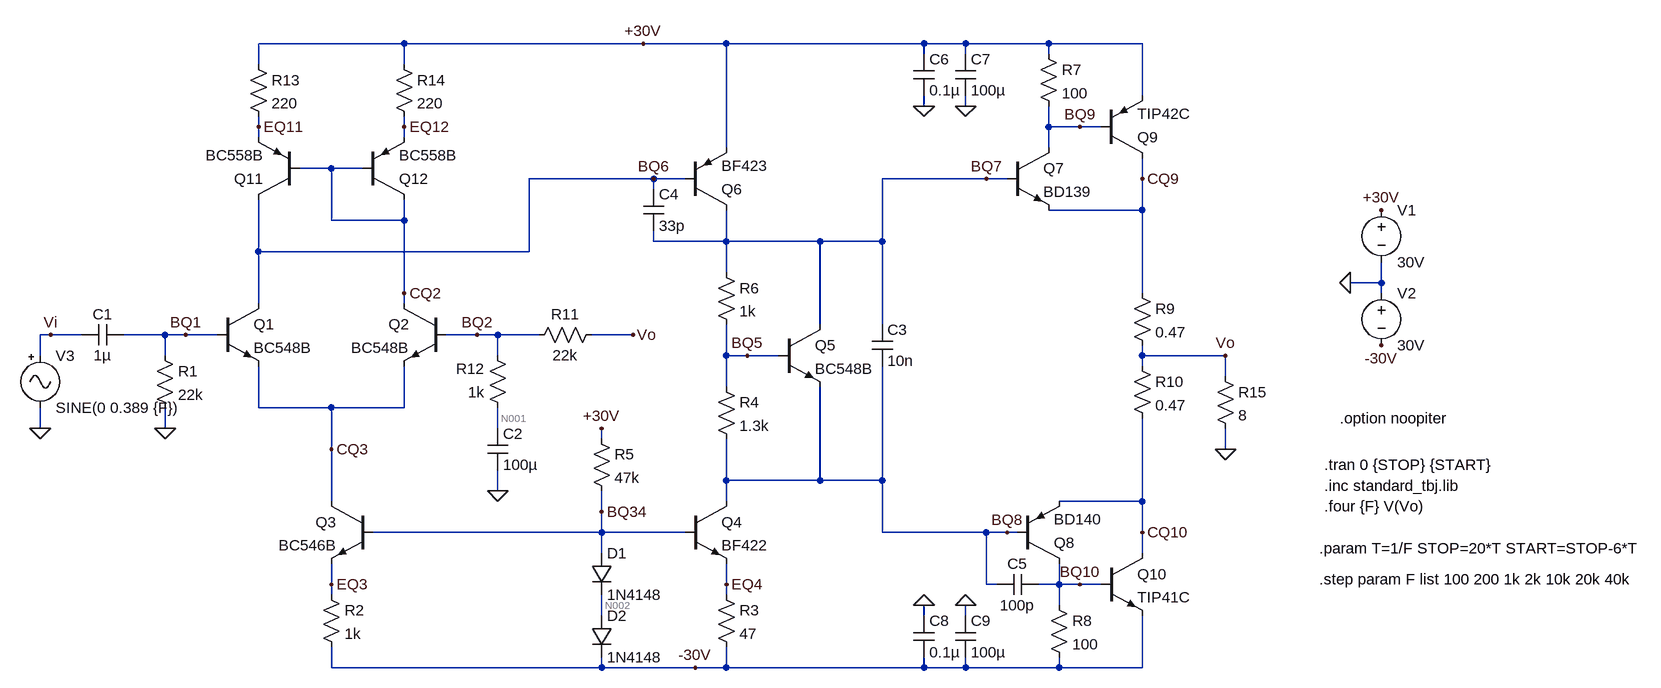
[diagram p0: schematic Clase_B_v3_THD.asc]
Clase_B_v3_THD.asc, the LTspice schematic file:
Version 4
SHEET 1 2480 1108
WIRE 96 -224 -128 -224
WIRE 464 -224 96 -224
WIRE 592 -224 464 -224
WIRE 896 -224 592 -224
WIRE 960 -224 896 -224
WIRE 1088 -224 960 -224
WIRE 1232 -224 1088 -224
WIRE 896 -208 896 -224
WIRE 960 -208 960 -224
WIRE 1088 -208 1088 -224
WIRE -128 -192 -128 -224
WIRE 96 -192 96 -224
WIRE 1232 -144 1232 -224
WIRE 896 -128 896 -144
WIRE 960 -128 960 -144
WIRE -128 -96 -128 -112
WIRE 96 -96 96 -112
WIRE 1088 -96 1088 -128
WIRE 1136 -96 1088 -96
WIRE 1168 -96 1136 -96
WIRE -128 -80 -128 -96
WIRE 96 -80 96 -96
WIRE 592 -64 592 -224
WIRE 1088 -64 1088 -96
WIRE -16 -32 -64 -32
WIRE 32 -32 -16 -32
WIRE 480 -16 288 -16
WIRE 528 -16 480 -16
WIRE 992 -16 832 -16
WIRE 1024 -16 992 -16
WIRE 1232 -16 1232 -48
WIRE 480 0 480 -16
WIRE 1232 32 1232 -16
WIRE 1232 32 1088 32
WIRE -16 48 -16 -32
WIRE 96 48 96 16
WIRE 96 48 -16 48
WIRE 480 80 480 64
WIRE 592 80 592 32
WIRE 592 80 480 80
WIRE 736 80 592 80
WIRE 832 80 832 -16
WIRE 832 80 736 80
WIRE -128 96 -128 16
WIRE 288 96 288 -16
WIRE 288 96 -128 96
WIRE 592 128 592 80
WIRE 1600 144 1600 112
WIRE 1600 144 1552 144
WIRE 96 160 96 48
WIRE 1232 160 1232 32
WIRE 1600 160 1600 144
WIRE -128 176 -128 96
WIRE 96 176 96 160
WIRE 736 208 736 80
WIRE 832 208 832 80
WIRE -448 224 -464 224
WIRE -400 224 -448 224
WIRE -272 224 -336 224
WIRE -240 224 -272 224
WIRE -192 224 -240 224
WIRE 208 224 160 224
WIRE 240 224 208 224
WIRE 304 224 240 224
WIRE 448 224 384 224
WIRE -464 256 -464 224
WIRE -272 256 -272 224
WIRE 240 256 240 224
WIRE 592 256 592 208
WIRE 624 256 592 256
WIRE 672 256 624 256
WIRE 1232 256 1232 240
WIRE 1360 256 1232 256
WIRE 1232 272 1232 256
WIRE 1360 288 1360 256
WIRE 592 304 592 256
WIRE -128 336 -128 272
WIRE -16 336 -128 336
WIRE 96 336 96 272
WIRE 96 336 -16 336
WIRE -464 368 -464 336
WIRE -272 368 -272 336
WIRE 240 368 240 336
WIRE 400 384 400 368
WIRE -16 400 -16 336
WIRE 1360 400 1360 368
WIRE 592 448 592 384
WIRE 736 448 736 304
WIRE 736 448 592 448
WIRE 832 448 832 272
WIRE 832 448 736 448
WIRE 240 464 240 432
WIRE -16 480 -16 400
WIRE 592 480 592 448
WIRE 1232 480 1232 352
WIRE 1232 480 1104 480
WIRE 400 496 400 464
WIRE 400 528 400 496
WIRE 400 528 48 528
WIRE 528 528 400 528
WIRE 832 528 832 448
WIRE 992 528 832 528
WIRE 1024 528 992 528
WIRE 1040 528 1024 528
WIRE 1232 528 1232 480
WIRE 400 560 400 528
WIRE 1232 560 1232 528
WIRE -16 608 -16 576
WIRE 592 608 592 576
WIRE 992 608 992 528
WIRE 1008 608 992 608
WIRE 1104 608 1104 576
WIRE 1104 608 1072 608
WIRE 1136 608 1104 608
WIRE 1168 608 1136 608
WIRE -16 624 -16 608
WIRE 592 624 592 608
WIRE 1104 640 1104 608
WIRE 400 656 400 624
WIRE 896 656 896 640
WIRE 960 656 960 640
WIRE -16 736 -16 704
WIRE 400 736 400 720
WIRE 400 736 -16 736
WIRE 544 736 400 736
WIRE 592 736 592 704
WIRE 592 736 544 736
WIRE 896 736 896 720
WIRE 896 736 592 736
WIRE 960 736 960 720
WIRE 960 736 896 736
WIRE 1104 736 1104 720
WIRE 1104 736 960 736
WIRE 1232 736 1232 656
WIRE 1232 736 1104 736
FLAG 1552 144 0
FLAG 1600 32 +30V
FLAG 464 -224 +30V
FLAG 1600 240 -30V
FLAG 544 736 -30V
FLAG 240 464 0
FLAG -464 368 0
FLAG 1360 256 Vo
FLAG -448 224 Vi
FLAG 480 -16 BQ6
FLAG -16 400 CQ3
FLAG -16 608 EQ3
FLAG 400 496 BQ34
FLAG 592 608 EQ4
FLAG 992 -16 BQ7
FLAG 1024 528 BQ8
FLAG 1136 -96 BQ9
FLAG 1136 608 BQ10
FLAG 1232 528 CQ10
FLAG 1232 -16 CQ9
FLAG -272 368 0
FLAG 448 224 Vo
FLAG -128 -96 EQ11
FLAG 96 -96 EQ12
FLAG 96 160 CQ2
FLAG 208 224 BQ2
FLAG -240 224 BQ1
FLAG 624 256 BQ5
FLAG 1360 400 0
FLAG 400 368 +30V
FLAG 896 -128 0
FLAG 960 -128 0
FLAG 896 640 0
FLAG 960 640 0
SYMBOL npn -192 176 R0
SYMATTR InstName Q1
SYMATTR Value BC548B
SYMBOL npn 160 176 M0
SYMATTR InstName Q2
SYMATTR Value BC548B
SYMBOL npn 48 480 M0
SYMATTR InstName Q3
SYMATTR Value BC546B
SYMBOL npn 528 480 R0
SYMATTR InstName Q4
SYMATTR Value BF422
SYMBOL npn 672 208 R0
SYMATTR InstName Q5
SYMATTR Value BC548B
SYMBOL pnp 528 32 M180
SYMATTR InstName Q6
SYMATTR Value BF423
SYMBOL res 576 112 R0
SYMATTR InstName R6
SYMATTR Value 1k
SYMBOL res 576 288 R0
SYMATTR InstName R4
SYMATTR Value 1.3k
SYMBOL diode 384 560 R0
SYMATTR InstName D1
SYMATTR Value 1N4148
SYMBOL diode 384 656 R0
SYMATTR InstName D2
SYMATTR Value 1N4148
SYMBOL res -32 608 R0
SYMATTR InstName R2
SYMATTR Value 1k
SYMBOL res 576 608 R0
SYMATTR InstName R3
SYMATTR Value 47
SYMBOL res 384 368 R0
SYMATTR InstName R5
SYMATTR Value 47k
SYMBOL voltage 1600 16 R0
WINDOW 123 0 0 Left 2
WINDOW 39 0 0 Left 2
SYMATTR InstName V1
SYMATTR Value 30V
SYMBOL voltage 1600 144 R0
SYMATTR InstName V2
SYMATTR Value 30V
SYMBOL res 1216 144 R0
SYMATTR InstName R9
SYMATTR Value 0.47
SYMBOL res 1216 256 R0
SYMATTR InstName R10
SYMATTR Value 0.47
SYMBOL npn 1024 -64 R0
SYMATTR InstName Q7
SYMATTR Value BD139
SYMBOL pnp 1168 -48 M180
SYMATTR InstName Q9
SYMATTR Value TIP42C
SYMBOL res 1072 -224 R0
SYMATTR InstName R7
SYMATTR Value 100
SYMBOL pnp 1040 576 M180
SYMATTR InstName Q8
SYMATTR Value BD140
SYMBOL npn 1168 560 R0
SYMATTR InstName Q10
SYMATTR Value TIP41C
SYMBOL res 1088 624 R0
SYMATTR InstName R8
SYMATTR Value 100
SYMBOL res 400 208 R90
WINDOW 0 0 56 VBottom 2
WINDOW 3 32 56 VTop 2
SYMATTR InstName R11
SYMATTR Value 22k
SYMBOL res 256 352 R180
WINDOW 0 36 76 Left 2
WINDOW 3 36 40 Left 2
SYMATTR InstName R12
SYMATTR Value 1k
SYMBOL cap 464 0 R0
SYMATTR InstName C4
SYMATTR Value 33p
SYMBOL cap 224 368 R0
SYMATTR InstName C2
SYMATTR Value 100µ
SYMBOL cap -400 240 R270
WINDOW 0 32 32 VTop 2
WINDOW 3 0 32 VBottom 2
SYMATTR InstName C1
SYMATTR Value 1µ
SYMBOL res -288 240 R0
SYMATTR InstName R1
SYMATTR Value 22k
SYMBOL pnp -64 16 R180
SYMATTR InstName Q11
SYMATTR Value BC558B
SYMBOL pnp 32 16 M180
SYMATTR InstName Q12
SYMATTR Value BC558B
SYMBOL res -144 -208 R0
SYMATTR InstName R13
SYMATTR Value 220
SYMBOL res 80 -208 R0
SYMATTR InstName R14
SYMATTR Value 220
SYMBOL cap 1072 592 R90
WINDOW 0 0 32 VBottom 2
WINDOW 3 32 32 VTop 2
SYMATTR InstName C5
SYMATTR Value 100p
SYMBOL res 1344 272 R0
SYMATTR InstName R15
SYMATTR Value 8
SYMBOL cap 816 208 R0
SYMATTR InstName C3
SYMATTR Value 10n
SYMBOL Misc\\signal -464 240 R0
WINDOW 123 0 0 Left 0
WINDOW 39 0 0 Left 0
SYMATTR InstName V3
SYMATTR Value SINE(0 0.389 {F})
SYMBOL cap 880 -208 R0
SYMATTR InstName C6
SYMATTR Value 0.1µ
SYMBOL cap 944 -208 R0
SYMATTR InstName C7
SYMATTR Value 100µ
SYMBOL cap 880 656 R0
SYMATTR InstName C8
SYMATTR Value 0.1µ
SYMBOL cap 944 656 R0
SYMATTR InstName C9
SYMATTR Value 100µ
TEXT 1512 456 Left 2 !.inc standard_tbj.lib
TEXT 1512 488 Left 2 !.four {F} V(Vo)
TEXT 1504 552 Left 2 !.param T=1/F STOP=20*T START=STOP-6*T
TEXT 1512 424 Left 2 !.tran 0 {STOP} {START}
TEXT 1536 352 Left 2 !.option noopiter
TEXT 1504 600 Left 2 !.step param F list 100 200 1k 2k 10k 20k 40k

The netlist it stands for:
* Clase_B_v3_THD.asc
Q1 BQ6 BQ1 CQ3 0 BC548B
Q2 CQ2 BQ2 CQ3 0 BC548B
Q3 CQ3 BQ34 EQ3 0 BC546B
Q4 BQ8 BQ34 EQ4 0 BF422
Q5 BQ7 BQ5 BQ8 0 BC548B
Q6 BQ7 BQ6 +30V 0 BF423
R6 BQ7 BQ5 1k
R4 BQ5 BQ8 1.3k
D1 BQ34 N002 1N4148
D2 N002 -30V 1N4148
R2 EQ3 -30V 1k
R3 EQ4 -30V 47
R5 +30V BQ34 47k
V1 +30V 0 30V
V2 0 -30V 30V
R9 CQ9 Vo 0.47
R10 Vo CQ10 0.47
Q7 BQ9 BQ7 CQ9 0 BD139
Q9 CQ9 BQ9 +30V 0 TIP42C
R7 +30V BQ9 100
Q8 BQ10 BQ8 CQ10 0 BD140
Q10 CQ10 BQ10 -30V 0 TIP41C
R8 BQ10 -30V 100
R11 Vo BQ2 22k
R12 N001 BQ2 1k
C4 BQ6 BQ7 33p
C2 N001 0 100µ
C1 Vi BQ1 1µ
R1 BQ1 0 22k
Q11 BQ6 CQ2 EQ11 0 BC558B
Q12 CQ2 CQ2 EQ12 0 BC558B
R13 +30V EQ11 220
R14 +30V EQ12 220
C5 BQ10 BQ8 100p
R15 Vo 0 8
C3 BQ7 BQ8 10n
V3 Vi 0 SINE(0 0.389 {F})
C6 +30V 0 0.1µ
C7 +30V 0 100µ
C8 0 -30V 0.1µ
C9 0 -30V 100µ
.model D D
.lib standard.dio
.model NPN NPN
.model PNP PNP
.lib standard.bjt
.inc standard_tbj.lib
.four {F} V(Vo)
.param T=1/F STOP=20*T START=STOP-6*T
.tran 0 {STOP} {START}
.option noopiter
.step param F list 100 200 1k 2k 10k 20k 40k
.backanno
.end

* Results of the author's LTspice run, read from the files saved beside the schematic
* Operating Point (first step), zero values left out:
*   f = 100 
*   V(bq6) = 29.28 V
*   V(bq1) = -19.12 mV
*   V(cq3) = -643.2 mV
*   V(cq2) = 29.26 V
*   V(bq2) = -23.93 mV
*   V(bq34) = -28.81 V
*   V(eq3) = -29.43 V
*   V(bq8) = -660.6 mV
*   V(eq4) = -29.53 V
*   V(bq7) = 652.5 mV
*   V(bq5) = 63.98 mV
*   V(+30v) = 30 V
*   V(n002) = -29.41 V
*   V(-30v) = -30 V
*   V(cq9) = 30.96 mV
*   V(vo) = -7.654 mV
*   V(cq10) = -46.72 mV
*   V(bq9) = 29.29 V
*   V(bq10) = -29.4 V
*   V(n001) = -23.93 mV
*   V(eq11) = 29.94 V
*   V(eq12) = 29.94 V
*   Ic(Q12) = -256.1 µA
*   Ib(Q12) = -868 nA
*   Ie(Q12) = 257 µA
*   Ic(Q11) = -256.1 µA
*   Ib(Q11) = -868.2 nA
*   Ie(Q11) = 257 µA
*   Ic(Q10) = 76.52 mA
*   Ib(Q10) = 615.4 µA
*   Ie(Q10) = -77.13 mA
*   Ic(Q8) = -6.577 mA
*   Ib(Q8) = -30.19 µA
*   Ie(Q8) = 6.607 mA
*   Ic(Q9) = -74.48 mA
*   Ib(Q9) = -537.8 µA
*   Ie(Q9) = 75.02 mA
*   Ic(Q7) = 7.659 mA
*   Ib(Q7) = 31.14 µA
*   Ie(Q7) = -7.691 mA
*   Ic(Q6) = -10.04 mA
*   Ib(Q6) = -54.28 µA
*   Ie(Q6) = 10.09 mA
*   Ic(Q4) = 10.04 mA
*   Ib(Q4) = 61.17 µA
*   Ie(Q4) = -10.1 mA
*   Ic(Q3) = 569.8 µA
*   Ib(Q3) = 1.383 µA
*   Ie(Q3) = -571.2 µA
*   Ic(Q5) = 9.419 mA
*   Ib(Q5) = 31.17 µA
*   Ie(Q5) = -9.45 mA
*   Ic(Q2) = 257.9 µA
*   Ib(Q2) = 739.6 nA
*   Ie(Q2) = -258.6 µA
*   Ic(Q1) = 310.4 µA
*   Ib(Q1) = 869.2 nA
*   Ie(Q1) = -311.2 µA
*   I(D2) = 1.189 mA
*   I(D1) = 1.189 mA
*   I(R15) = -956.8 µA
*   I(R14) = 257 µA
*   I(R13) = 257 µA
*   I(R1) = -869.2 nA
*   I(R11) = 739.6 nA
*   I(R8) = 5.962 mA
*   I(R7) = 7.122 mA
*   I(R10) = 83.12 mA
*   I(R9) = 82.17 mA
*   I(R5) = 1.251 mA
*   I(R3) = 10.1 mA
*   I(R2) = 571.2 µA
*   I(R4) = 557.4 µA
*   I(R6) = 588.5 µA
*   I(V2) = -94.95 mA
*   I(V1) = -93.99 mA
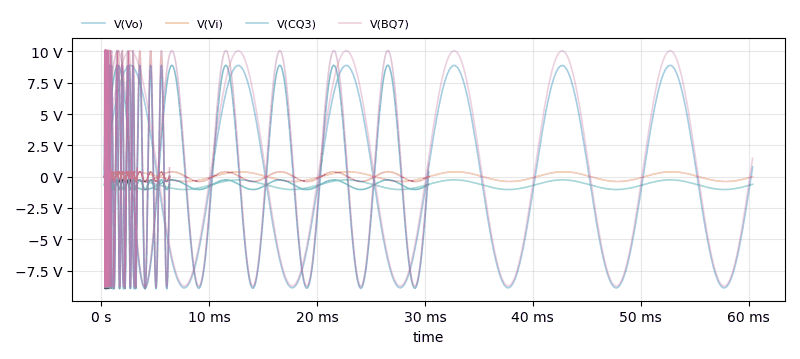
[diagram p1: Transient Analysis of Clase_B_v3_THD.asc, plotted from the saved traces]
* Transient Analysis, 7 runs:
*   V(Vo) [f=100]: min -8.889 V, max 8.888 V, average -843.5 µV, rms 6.28 V, last 775.1 mV
*   V(Vo) [f=200]: min -8.923 V, max 8.902 V, average -8.778 mV, rms 6.292 V, last 384.9 mV
*   V(Vo) [f=1000]: min -8.956 V, max 8.88 V, average -42.75 mV, rms 6.297 V, last 36.3 mV
*   V(Vo) [f=2000]: min -8.946 V, max 8.884 V, average -33.56 mV, rms 6.297 V, last -1.66 mV
*   V(Vo) [f=10000]: min -8.933 V, max 8.904 V, average -15.35 mV, rms 6.297 V, last -50.41 mV
*   V(Vo) [f=20000]: min -8.93 V, max 8.907 V, average -11.68 mV, rms 6.297 V, last -94.71 mV
*   V(Vo) [f=40000]: min -8.927 V, max 8.908 V, average -10.74 mV, rms 6.298 V, last -184.7 mV
*   V(Vi) [f=100]: min -389 mV, max 389 mV, average 2.171 µV, rms 274.9 mV, last 0 V
*   V(Vi) [f=200]: min -389 mV, max 388.8 mV, average -1.855 µV, rms 274.9 mV, last 0 V
*   V(Vi) [f=1000]: min -388.9 mV, max 389 mV, average -4.455 µV, rms 274.9 mV, last 0 V
*   V(Vi) [f=2000]: min -388.8 mV, max 389 mV, average 1.144 µV, rms 274.9 mV, last 0 V
*   V(Vi) [f=10000]: min -389 mV, max 389 mV, average -5.12 µV, rms 274.9 mV, last 0 V
*   V(Vi) [f=20000]: min -389 mV, max 389 mV, average -355.6 nV, rms 274.9 mV, last 0 V
*   V(Vi) [f=40000]: min -389 mV, max 389 mV, average -228.5 nV, rms 274.9 mV, last 0 V
*   V(CQ3) [f=100]: min -1.029 V, max -256.8 mV, average -643.2 mV, rms 698.7 mV, last -615.2 mV
*   V(CQ3) [f=200]: min -1.031 V, max -256.1 mV, average -643.5 mV, rms 699.2 mV, last -629.3 mV
*   V(CQ3) [f=1000]: min -1.032 V, max -256.6 mV, average -644.5 mV, rms 700.2 mV, last -641.6 mV
*   V(CQ3) [f=2000]: min -1.032 V, max -256.4 mV, average -644.1 mV, rms 699.9 mV, last -642.8 mV
*   V(CQ3) [f=10000]: min -1.031 V, max -255.7 mV, average -643.5 mV, rms 699.3 mV, last -644 mV
*   V(CQ3) [f=20000]: min -1.031 V, max -255.6 mV, average -643.3 mV, rms 699.1 mV, last -644.9 mV
*   V(CQ3) [f=40000]: min -1.031 V, max -255.5 mV, average -643.1 mV, rms 699 mV, last -646.4 mV
*   V(BQ7) [f=100]: min -8.746 V, max 10.06 V, average 658 mV, rms 6.669 V, last 1.461 V
*   V(BQ7) [f=200]: min -8.782 V, max 10.08 V, average 649.6 mV, rms 6.681 V, last 1.058 V
*   V(BQ7) [f=1000]: min -8.817 V, max 10.05 V, average 613.6 mV, rms 6.682 V, last 698.3 mV
*   V(BQ7) [f=2000]: min -8.806 V, max 10.06 V, average 623.4 mV, rms 6.683 V, last 659.4 mV
*   V(BQ7) [f=10000]: min -8.793 V, max 10.08 V, average 642.6 mV, rms 6.685 V, last 610.7 mV
*   V(BQ7) [f=20000]: min -8.79 V, max 10.08 V, average 646.4 mV, rms 6.685 V, last 568.3 mV
*   V(BQ7) [f=40000]: min -8.786 V, max 10.08 V, average 647.1 mV, rms 6.685 V, last 481.4 mV
* From the log:
*   N-Period=1
*   Fourier components of V(vo)
*   DC component:-0.00233964
*   Harmonic  Frequency   Fourier   Normalized   Phase    Normalized
*    Number     [Hz]     Component   Component  [degree]  Phase [deg]
*       1     1.000e+02  8.877e+00  1.000e+00      5.01°      0.00°
*       2     2.000e+02  4.118e-04  4.640e-05    -82.47°    -87.48°
*       3     3.000e+02  2.662e-03  2.999e-04     29.67°     24.66°
*       4     4.000e+02  3.350e-04  3.774e-05     60.51°     55.50°
*       5     5.000e+02  6.509e-03  7.332e-04      6.71°      1.70°
*       6     6.000e+02  1.030e-04  1.160e-05    156.88°    151.86°
*       7     7.000e+02  1.478e-03  1.666e-04    -21.56°    -26.57°
*       8     8.000e+02  4.446e-04  5.009e-05     66.90°     61.89°
*       9     9.000e+02  2.225e-03  2.507e-04      1.40°     -3.61°
*   Total Harmonic Distortion: 0.085110%(0.095055%)
*   N-Period=1
*   Fourier components of V(vo)
*   DC component:-0.00502986
*   Harmonic  Frequency   Fourier   Normalized   Phase    Normalized
*    Number     [Hz]     Component   Component  [degree]  Phase [deg]
*       1     2.000e+02  8.894e+00  1.000e+00      2.51°      0.00°
*       2     4.000e+02  7.689e-04  8.646e-05     74.45°     71.94°
*       3     6.000e+02  2.527e-03  2.841e-04     21.47°     18.96°
*       4     8.000e+02  4.634e-04  5.211e-05    -91.10°    -93.61°
*       5     1.000e+03  5.427e-03  6.103e-04     -3.06°     -5.57°
*       6     1.200e+03  2.646e-04  2.976e-05    -40.15°    -42.66°
*       7     1.400e+03  1.995e-03  2.243e-04    -33.84°    -36.35°
*       8     1.600e+03  1.014e-03  1.141e-04   -122.93°   -125.44°
*       9     1.800e+03  1.976e-03  2.222e-04    -18.05°    -20.56°
*   Total Harmonic Distortion: 0.075955%(0.082626%)
*   N-Period=1
*   Fourier components of V(vo)
*   DC component:-0.0385766
*   Harmonic  Frequency   Fourier   Normalized   Phase    Normalized
*    Number     [Hz]     Component   Component  [degree]  Phase [deg]
*       1     1.000e+03  8.899e+00  1.000e+00      0.49°      0.00°
*       2     2.000e+03  2.084e-03  2.341e-04   -110.25°   -110.74°
*       3     3.000e+03  3.092e-03  3.475e-04      9.95°      9.47°
*       4     4.000e+03  1.320e-03  1.484e-04    101.21°    100.72°
*       5     5.000e+03  5.275e-03  5.927e-04    -15.51°    -16.00°
*       6     6.000e+03  6.298e-04  7.077e-05     30.96°     30.47°
*       7     7.000e+03  2.058e-03  2.312e-04    -56.95°    -57.44°
*       8     8.000e+03  1.786e-03  2.006e-04     59.43°     58.95°
*       9     9.000e+03  1.347e-03  1.513e-04    -37.88°    -38.37°
*   Total Harmonic Distortion: 0.081885%(0.087732%)
*   N-Period=1
*   Fourier components of V(vo)
*   DC component:-0.0315676
*   Harmonic  Frequency   Fourier   Normalized   Phase    Normalized
*    Number     [Hz]     Component   Component  [degree]  Phase [deg]
*       1     2.000e+03  8.900e+00  1.000e+00      0.21°      0.00°
*       2     4.000e+03  4.912e-04  5.519e-05    -39.79°    -40.00°
*       3     6.000e+03  4.652e-03  5.226e-04     -0.72°     -0.93°
*       4     8.000e+03  9.621e-05  1.081e-05     90.21°     90.00°
*       5     1.000e+04  6.036e-03  6.782e-04    -20.76°    -20.97°
*       6     1.200e+04  9.437e-04  1.060e-04    -94.48°    -94.69°
*       7     1.400e+04  2.387e-03  2.682e-04    -66.67°    -66.88°
*       8     1.600e+04  7.793e-04  8.756e-05    162.31°    162.10°
*       9     1.800e+04  4.843e-04  5.441e-05     29.58°     29.37°
*   Total Harmonic Distortion: 0.091110%(0.093289%)
*   N-Period=1
*   Fourier components of V(vo)
*   DC component:-0.0146478
*   Harmonic  Frequency   Fourier   Normalized   Phase    Normalized
*    Number     [Hz]     Component   Component  [degree]  Phase [deg]
*       1     1.000e+04  8.899e+00  1.000e+00     -0.23°      0.00°
*       2     2.000e+04  2.790e-04  3.135e-05   -121.47°   -121.24°
*       3     3.000e+04  3.856e-03  4.333e-04      8.31°      8.54°
*       4     4.000e+04  1.535e-04  1.725e-05    103.10°    103.33°
*       5     5.000e+04  4.740e-03  5.327e-04    -14.43°    -14.20°
*       6     6.000e+04  2.517e-04  2.829e-05   -116.44°   -116.21°
*       7     7.000e+04  2.640e-03  2.966e-04    -35.71°    -35.48°
*       8     8.000e+04  8.874e-05  9.971e-06    105.05°    105.28°
*       9     9.000e+04  1.043e-03  1.172e-04    -46.00°    -45.77°
*   Total Harmonic Distortion: 0.075853%(0.085258%)
*   N-Period=1
*   Fourier components of V(vo)
*   DC component:-0.0111186
*   Harmonic  Frequency   Fourier   Normalized   Phase    Normalized
*    Number     [Hz]     Component   Component  [degree]  Phase [deg]
*       1     2.000e+04  8.899e+00  1.000e+00     -0.54°      0.00°
*       2     4.000e+04  1.332e-03  1.497e-04   -107.27°   -106.73°
*       3     6.000e+04  2.552e-03  2.868e-04     19.57°     20.11°
*       4     8.000e+04  1.013e-03  1.139e-04     97.32°     97.86°
*       5     1.000e+05  4.583e-03  5.150e-04     -8.57°     -8.03°
*       6     1.200e+05  8.050e-04  9.046e-05    -99.20°    -98.66°
*       7     1.400e+05  2.017e-03  2.266e-04    -37.20°    -36.66°
*       8     1.600e+05  7.836e-04  8.805e-05     77.90°     78.44°
*       9     1.800e+05  1.777e-03  1.997e-04    -31.10°    -30.56°
*   Total Harmonic Distortion: 0.070000%(0.084901%)
*   N-Period=1
*   Fourier components of V(vo)
*   DC component:-0.010826
*   Harmonic  Frequency   Fourier   Normalized   Phase    Normalized
*    Number     [Hz]     Component   Component  [degree]  Phase [deg]
*       1     4.000e+04  8.901e+00  1.000e+00     -1.13°      0.00°
*       2     8.000e+04  9.024e-04  1.014e-04   -153.47°   -152.34°
*       3     1.200e+05  5.296e-03  5.950e-04      0.66°      1.79°
*       4     1.600e+05  1.148e-03  1.290e-04   -122.61°   -121.48°
*       5     2.000e+05  6.097e-03  6.849e-04    -17.38°    -16.25°
*       6     2.400e+05  5.838e-04  6.559e-05    173.44°    174.57°
*       7     2.800e+05  5.971e-04  6.708e-05    -37.03°    -35.90°
*       8     3.200e+05  9.604e-04  1.079e-04    -94.52°    -93.39°
*       9     3.600e+05  1.327e-03  1.491e-04     79.99°     81.12°
*   Total Harmonic Distortion: 0.094480%(0.105926%)